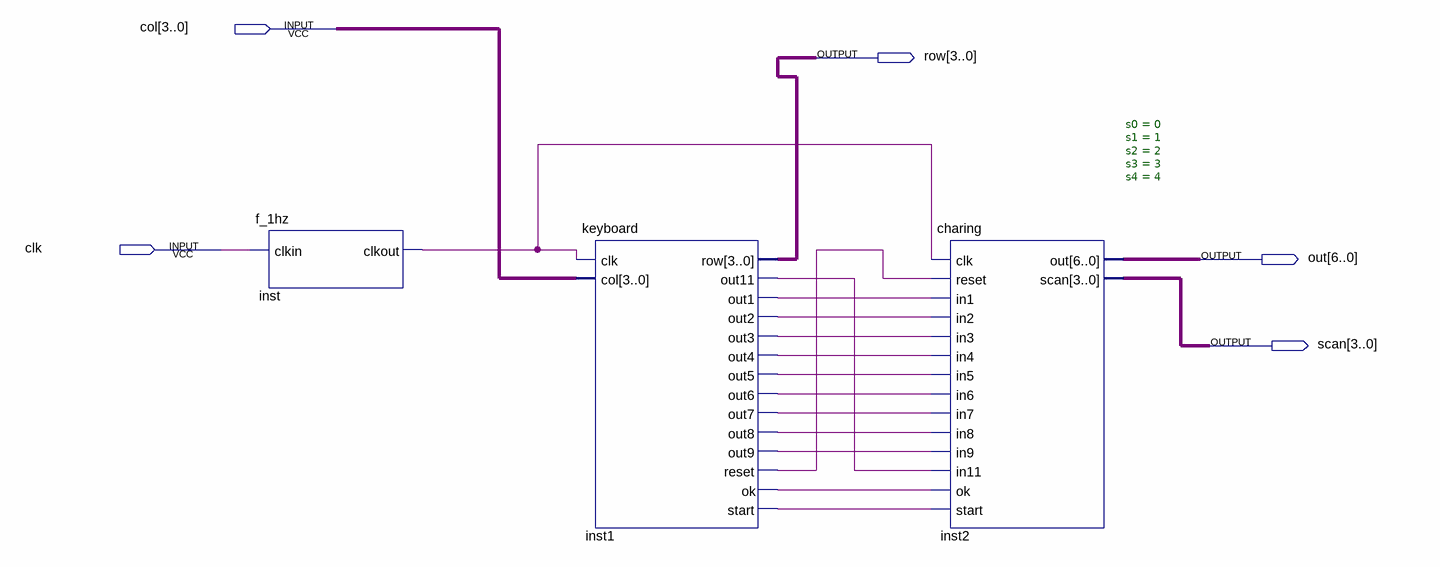
[diagram p0: schematic sheet]
// Quartus schematic code.bdf as structural Verilog: 3 symbols, 5 pins
module code (
  input  [3:0] col,
  input  clk,
  output [3:0] row,
  output [6:0] out,
  output [3:0] scan
);

  wire inst1_ok, inst1_out1, inst1_out2, inst1_out3, inst1_out4, inst1_out5, inst1_out6, inst1_out7,
       inst1_out8, inst1_out9, inst1_out11, inst1_reset, inst1_start, inst_clkout;

  f_1hz inst (.clkin(clk), .clkout(inst_clkout));
  keyboard inst1 (
    .clk(inst_clkout), .col(col), .row(row), .out11(inst1_out11), .out1(inst1_out1), .out2(inst1_out2),
    .out3(inst1_out3), .out4(inst1_out4), .out5(inst1_out5), .out6(inst1_out6), .out7(inst1_out7),
    .out8(inst1_out8), .out9(inst1_out9), .reset(inst1_reset), .ok(inst1_ok), .start(inst1_start));
  charing #(.s0(0), .s1(1), .s2(2), .s3(3), .s4(4)) inst2 (
    .clk(inst_clkout), .reset(inst1_reset), .in1(inst1_out1), .in2(inst1_out2), .in3(inst1_out3),
    .in4(inst1_out4), .in5(inst1_out5), .in6(inst1_out6), .in7(inst1_out7), .in8(inst1_out8),
    .in9(inst1_out9), .in11(inst1_out11), .ok(inst1_ok), .start(inst1_start), .out(out), .scan(scan));
endmodule
